# EasyEDA Pro project ProProject_KVM-Card-Mini-HV2.6_2023-09-18.epro, board PCB1
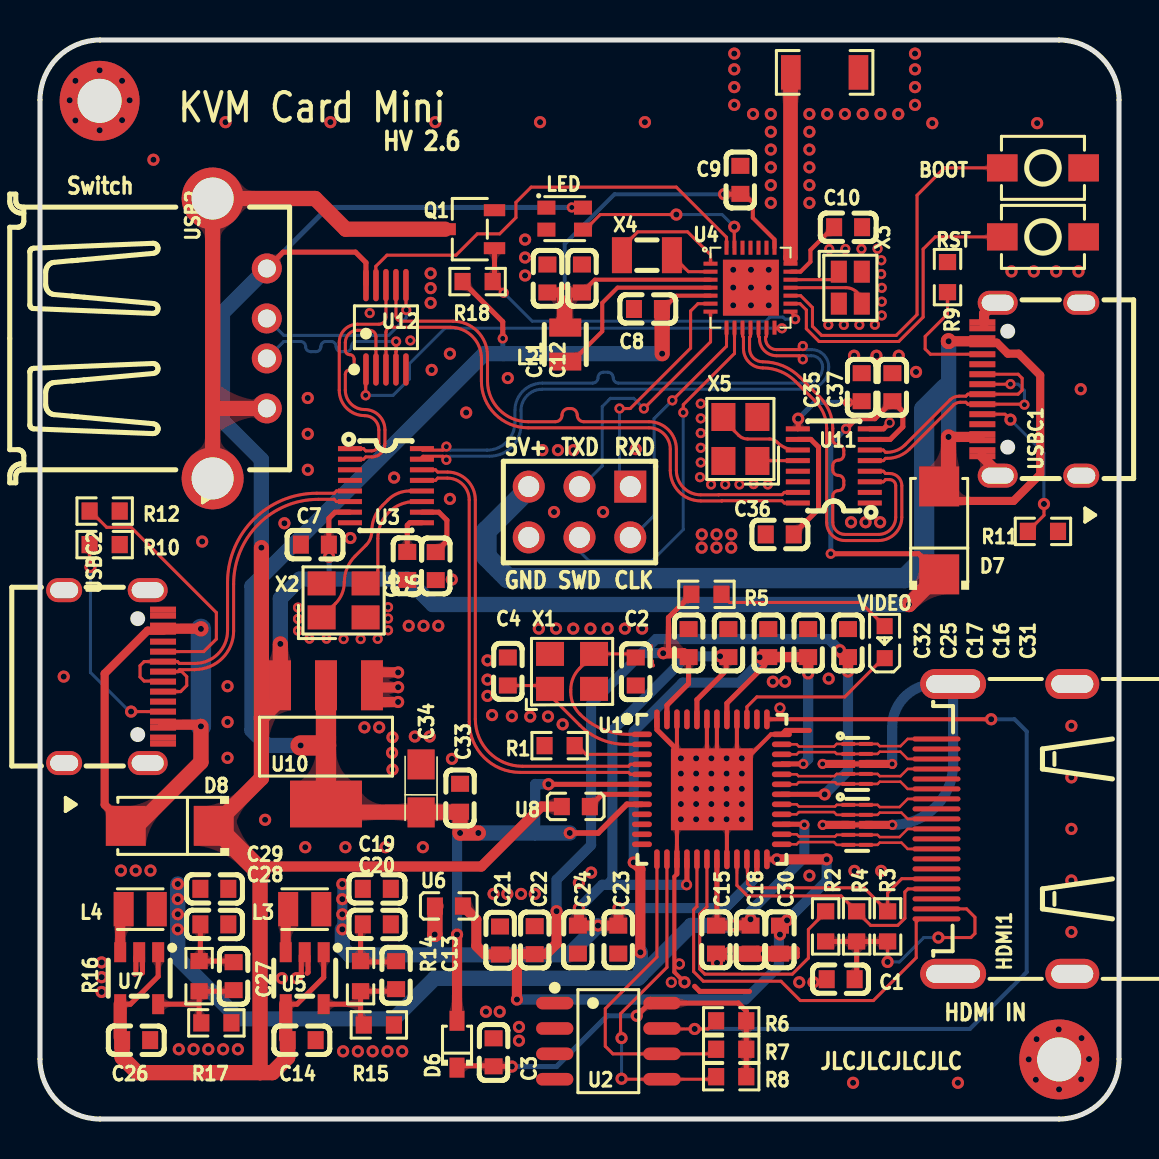
[diagram p4: board, top side]
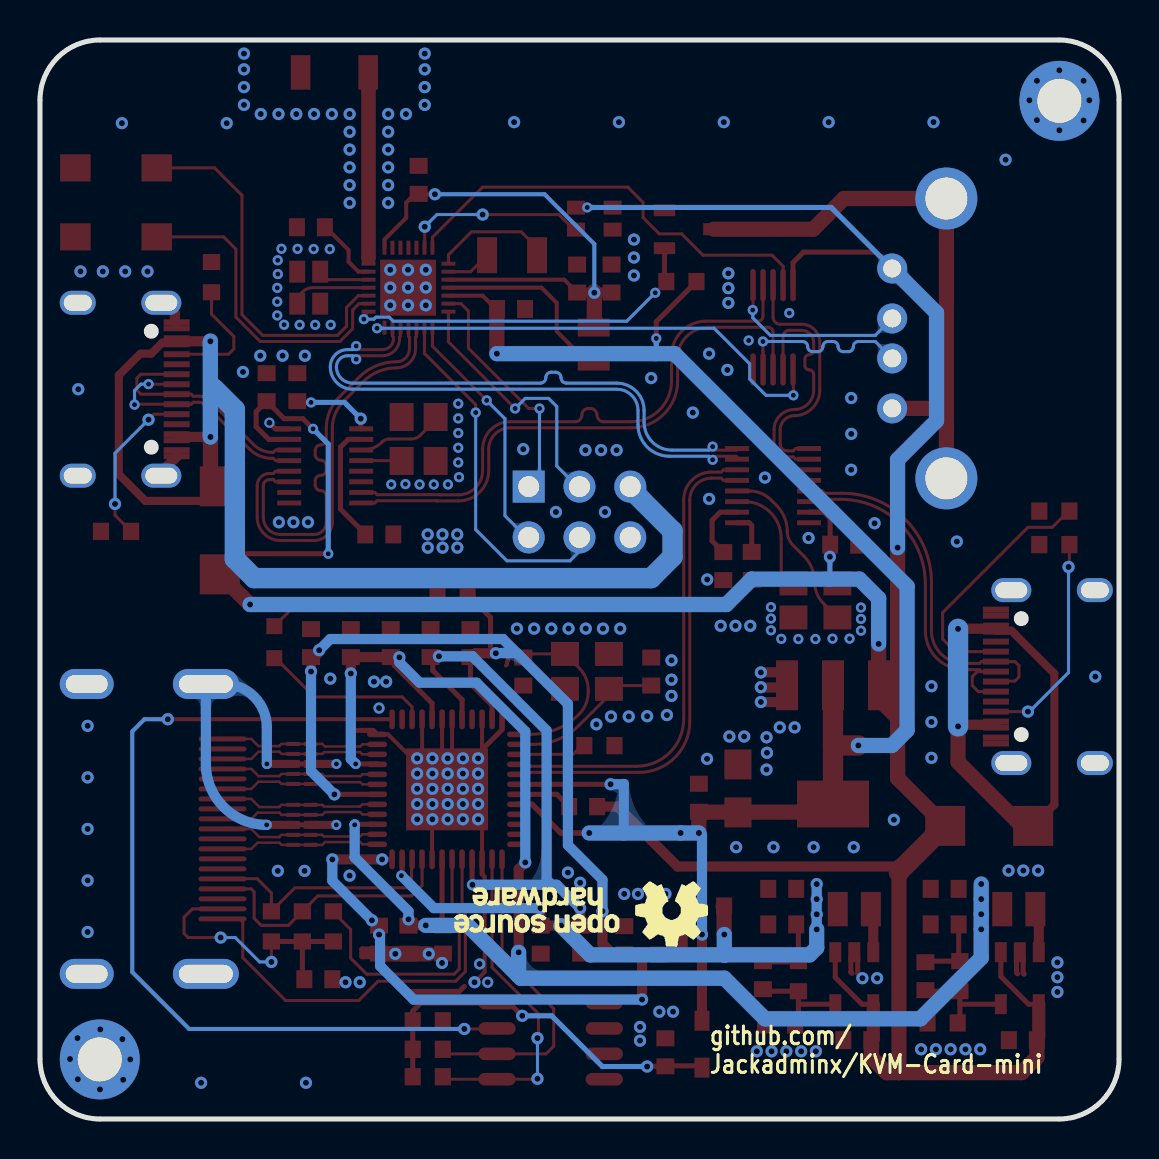
[diagram p5: board, bottom side, seen from below]

Outline 53.98 x 53.98 mm; copper layers: Top Layer, Bottom Layer. Coordinates in mm from the lower left corner of the outline.
Outline path: 0,50.98 arc(0.88,53.1) 3,53.98 50.98,53.98 arc(53.1,53.1) 53.98,50.98 53.98,3 arc(53.1,0.88) 50.98,0 3,0 arc(0.88,0.88) 0,3 0,50.98
Stack: Top Layer 0.035mm / Dielectric1 1.51mm FR4 er 4.5 / Bottom Layer 0.035mm

## Design rules (mm)
net HDMI_CP: DPC
net HDMI_0N: DP0
net HDMI_0P: DP0
net HDMI_1N: DP1
net HDMI_1P: DP1
net HDMI_2N: DP2
net HDMI_2P: DP2
net HDMI_CN: DPC
net USB1_N: USB2
net USB1_P: USB2
net USB_P: USB1
net USB_N: USB1
net USB0_P: HUB-A1
net USB0_N: HUB-A1
net DM4: HUB-A2
net DP4: HUB-A2
net USB1A_P: HUB-B2
net USB1A_N: HUB-B2
net USB0B_N: HUB-A3
net USB0B_P: HUB-A3
net USB1B_N: HUB-B1
net USB1B_P: HUB-B1
net USBA_P: USB-A
net USBA_N: USB-A
template: 用户自定义配置
spacing safeClearance (default): track to track 0.152, other pairs 0.102 to 0.3
track width trackWidth (default): min 0.102, default 0.152, max 2.54
differential pair differentialPair (default): width min 0.127, default 0.254, max 2.54; gap min 0.152, default 0.152
via viaSize (default): diameter min 0.5, default 0.508, max 10; hole min 0.254, default 0.305, max 5.999
net GND uses ANT
net ANT uses ANT

## Placement (name value [footprint] x y rotation side)
BOOT  -  [SW-SMD_L4.0-W2.9-LS5.0]  50.18 47.58 180 top
C1  100nF  [C0603]  40.06 6.99 0 top
C2  20pf  [C0603]  29.8 22.39 90 top
C3  100nF  [C0603]  22.69 3.34 90 top
C4  20pf  [C0603]  23.4 22.39 270 top
C5  10uF  [C0603]  19.8 27.66 270 top
C6  10uF  [C0603]  18.37 27.67 270 top
C7  10uF  [C0603]  13.75 28.73 180 top
C8  2.2uf  [C0603]  30.41 40.52 0 top
C9  100nF  [C0603]  35.04 46.98 90 top
C10  2.2uf  [C0603]  40.43 44.61 180 top
C11  2.2uf  [C0603]  25.39 42.05 270 top
C12  2.2uf  [C0603]  27.11 42.05 270 top
C13  20pf  [C0603]  17.82 7.2 90 top
C14  10uf  [C0603]  13.09 3.95 180 top
C15  100nF  [C0603]  33.82 8.98 90 top
C16  100nF  [C0603]  38.43 23.81 270 top
C17  100nF  [C0603]  36.43 23.81 270 top
C18  100nF  [C0603]  35.55 8.98 90 top
C19  10uf  [C0603]  16.85 11.52 180 top
C20  22uf  [C0603]  16.85 9.74 180 top
C21  22uf  [C0603]  23.02 8.93 270 top
C22  22uf  [C0603]  24.75 8.95 270 top
C23  100nF  [C0603]  28.93 8.98 90 top
C24  100nF  [C0603]  26.91 8.98 90 top
C25  100nF  [C0603]  34.44 23.81 270 top
C26  10uf  [C0603]  4.81 3.95 180 top
C27  20pf  [C0603]  9.69 7.15 90 top
C28  10uf  [C0603]  8.72 9.74 180 top
C29  22uf  [C0603]  8.72 11.52 180 top
C30  100nF  [C0603]  37.02 8.98 90 top
C31  100nF  [C0603]  40.42 23.81 270 top
C32  100nF  [C0603]  32.45 23.81 270 top
C33  100nF  [C0603]  21.02 16.07 90 top
C34  10uF  [CASE-A_3216]  19.07 16.54 90 top
C35  10uF  [C0603]  41.11 36.61 90 top
C36  10uF  [C0603]  37.01 29.24 180 top
C37  10uF  [C0603]  42.64 36.61 90 top
D1  -  [SLP2510P8_L2.5-W1.0-P0.50-BL]  40.88 17.76 270 top
D2  -  [SLP2510P8_L2.5-W1.0-P0.50-BL]  40.88 14.72 270 top
D6  1N5819WS  [SOD-323_L1.8-W1.3-LS2.5-RD]  20.86 3.74 90 top
D7  SS34  [SMA_L4.3-W2.6-LS5.2-RD]  44.98 29.45 90 top
D8  SS34  [SMA_L4.3-W2.6-LS5.2-RD]  6.49 14.67 180 top
H1  210-72-03GB01  [HDR-TH_6P-P2.54-V-R2-C3-S2.54_A2541WV-2X3P]  26.99 30.37 180 top
HDMI1  -  [HDMI-SMD_HDMI-019S]  48.25 14.51 90 top
L1  RFECA3216060A1T  [ANT-SMD_L3.1-W1.6]  39.25 52.36 0 top
L2  22uH  [IND-SMD_L2.0-W1.6_NR201610]  26.28 38.74 90 top
L3  2.2uH  [IND-SMD_L2.0-W1.6]  13.24 10.5 180 top
L4  2.2uH  [IND-SMD_L2.0-W1.6]  5.01 10.5 180 top
LED  WS2812B-2020  [LED-SMD_4P-L2.0-W2.0-TL_WS2812B-2020]  26.25 45.04 0 top
NOREF  -  [Pad_e43]  2.98 50.94 0 top
NOREF#2  -  [Pad_e155]  50.99 2.98 0 top
Q1  AO3400A  [SOT-23-3_L2.9-W1.6-P1.90-LS2.8-BR]  21.5 44.51 0 top
R1  4k7  [R0603]  25.99 18.68 180 top
R2  1k  [R0603]  39.3 9.64 270 top
R3  47k  [R0603]  42.4 9.64 90 top
R4  47k  [R0603]  40.85 9.64 90 top
R5  1k  [R0603]  33.34 26.25 180 top
R6  4k7  [R0603]  34.58 4.91 0 top
R7  4k7  [R0603]  34.58 3.49 0 top
R8  4k7  [R0603]  34.58 2.12 0 top
R9  5.1K  [R0603]  45.4 42.12 270 top
R10  5.1K  [R0603]  3.24 28.74 180 top
R11  5.1K  [R0603]  50.18 29.4 180 top
R12  5.1K  [R0603]  3.24 30.41 180 top
R14  680K  [R0603]  16.04 7.15 90 top
R15  150K  [R0603]  16.95 4.71 180 top
R16  150K  [R0603]  7.96 7.15 90 top
R17  150K  [R0603]  8.82 4.81 180 top
R18  10K  [R0603]  21.89 41.89 180 top
RST  -  [SW-SMD_L4.0-W2.9-LS5.0]  50.18 44.13 180 top
U1  MS2109  [QFN-48_L7.0-W7.0-P0.50-TL-EP4.1]  33.61 16.49 0 top
U2  -  [SOP-8_L4.9-W3.9-P1.27-LS6.0-BL]  28.43 3.9 270 top
U3  SL2.1s  [SSOP-16_L4.6-W2.6-P0.53-LS4.0-BL]  17.31 31.68 270 top
U4  CH582F  [QFN-28_L4.0-W4.0-P0.40-BL-EP2.8]  35.55 41.59 270 top
U5  -  [SOT-23-5_L3.0-W1.7-P0.95-LS2.8-BR]  13.24 7.05 90 top
U6  BLM18PG121SN1D  [L0603]  20.46 10.65 0 top
U7  -  [SOT-23-5_L3.0-W1.7-P0.95-LS2.8-BR]  4.96 7.05 90 top
U8  BLM18PG121SN1D  [L0603]  26.81 15.63 0 top
U10  AMS1117-3.3  [SOT-223-3_L6.5-W3.4-P2.30-LS7.0-BR]  14.31 18.73 90 top
U11  SL2.1s  [SSOP-16_L4.6-W2.6-P0.53-LS4.0-BL]  39.71 32.67 90 top
U12  CH442E  [MSOP-10_L3.0-W3.0-P0.50-LS5.0-BL]  17.31 39.61 0 top
USB2  902-131A1011D10100  [USB-A-TH__USB-AF-90]  9.99 39.05 270 top
USBC1  TYPE-C-31-M-12  [USB-C_SMD-TYPE-C-31-M-12]  49.62 36.51 90 top
USBC2  TYPE-C-31-M-12  [USB-C_SMD-TYPE-C-31-M-12]  3.68 22.13 270 top
VIDEO  -  [LED_0603]  42.25 23.91 90 top
X1  -  [OSC-SMD_4P-L3.2-W2.5-BL]  26.62 22.39 0 top
X2  12MHz  [CRYSTAL-SMD_4P-L3.2-W2.5-BL]  15.19 25.94 0 top
X3  32MHz  [CRYSTAL-SMD_4P-L2.0-W1.6-BL-2]  40.54 41.59 270 top
X4  32.768kHz  [FC-135R_L3.2-W1.5]  30.36 43.21 0 top
X5  12MHz  [CRYSTAL-SMD_4P-L3.2-W2.5-BL]  35.04 34.02 90 top

## Footprints (pads in the part's own frame, mm; a bottom-side part is the same pattern mirrored in y, then rotated)
ANT-SMD_L3.1-W1.6
  rect 0.984x1.728 smd: 1(-1.692,0) 2(1.692,0)
C0603
  rect 0.8x0.9 smd: 1(-0.7,0) 2(0.7,0)
CASE-A_3216
  rect 1.5x1.359 smd: 1(-1.2,0) 2(1.2,0)
CRYSTAL-SMD_4P-L2.0-W1.6-BL-2
  rect 1.1x0.8 smd: 1(-0.8,-0.575) 2(0.8,-0.575) 3(0.8,0.575) 4(-0.8,0.575)
CRYSTAL-SMD_4P-L3.2-W2.5-BL
  rect 1.4x1.2 smd: 1(-1.1,-0.85) 2(1.1,-0.85) 3(1.1,0.85) 4(-1.1,0.85)
FC-135R_L3.2-W1.5
  rect 1x1.8 smd: 1(-1.25,0) 2(1.25,0)
HDMI-SMD_HDMI-019S
  oval 0.25x2.4 smd: 1(4.501,3.396) 2(4.001,3.396) 3(3.501,3.396) 4(3.001,3.396) 5(2.501,3.396) 6(2.001,3.396) 7(1.5,3.396) 8(1,3.396) 9(0.5,3.396) 10(0,3.396) 11(-0.5,3.396) 12(-1,3.396) 13(-1.5,3.396) 14(-2.001,3.396) 15(-2.501,3.396) 16(-3.001,3.396) 17(-3.501,3.396) 18(-4.001,3.396) 19(-4.501,3.396)
  oval 1.5x2.7 hole 0.9x2.1: 20(7.25,-3.397) 21(-7.25,-3.397)
  oval 1.5x3.3 hole 0.9x2.7: 22(7.25,2.564) 23(-7.25,2.564)
HDR-TH_6P-P2.54-V-R2-C3-S2.54_A2541WV-2X3P
  rect 1.6x1.6 hole 1.05: 1(-2.54,-1.27)
  round 1.6 hole 1.05: 2(-2.54,1.27) 3(0,-1.27) 4(0,1.27) 5(2.54,-1.27) 6(2.54,1.27)
IND-SMD_L2.0-W1.6
  rect 1x1.72 smd: 1(0.828,0) 2(-0.828,0)
IND-SMD_L2.0-W1.6_NR201610
  rect 0.9x1.6 smd: 1(-0.85,0) 2(0.85,0)
L0603
  rect 0.8x0.864 smd: 1(-0.7,0) 2(0.7,0)
LED-SMD_4P-L2.0-W2.0-TL_WS2812B-2020
  rect 0.9x0.7 smd: 1(-0.915,0.55) 2(-0.915,-0.55) 3(0.915,-0.55) 4(0.915,0.55)
LED_0603
  rect 0.8x0.8 smd: 1(-0.851,-0.01) 2(0.75,-0.005)
MSOP-10_L3.0-W3.0-P0.50-LS5.0-BL
  oval 0.28x1.62 smd: 1(-1,-2.11) 2(-0.5,-2.11) 3(0,-2.11) 4(0.5,-2.11) 5(1,-2.11) 6(1,2.11) 7(0.5,2.11) 8(0,2.11) 9(-0.5,2.11) 10(-1,2.11)
OSC-SMD_4P-L3.2-W2.5-BL
  rect 1.4x1.2 smd: 1(-1.1,-0.875) 2(1.1,-0.875) 3(1.1,0.875) 4(-1.1,0.875)
Pad_e43
  round 4 hole 2.2: 1(0,0)
Pad_e155
  round 4 hole 2.2: 1(0,0)
QFN-28_L4.0-W4.0-P0.40-BL-EP2.8
  rect 0.2x0.7 smd: 1(-1.2,-2) 2(-0.8,-2) 3(-0.4,-2) 4(-0.001,-2) 5(0.4,-2) 6(0.8,-2) 7(1.2,-2) 15(1.2,2) 16(0.8,2) 17(0.4,2) 18(0,2) 19(-0.4,2) 20(-0.8,2) 21(-1.2,2)
  rect 0.7x0.2 smd: 8(2,-1.2) 9(2,-0.8) 10(2,-0.4) 11(1.999,0) 12(2,0.4) 13(2,0.8) 14(2,1.2) 22(-2,1.2) 23(-2,0.8) 24(-2,0.4) 25(-2,0) 26(-2,-0.4) 27(-2,-0.8) 28(-2,-1.2)
  rect 2.8x2.8 smd: 29(0.001,0.02)
QFN-48_L7.0-W7.0-P0.50-TL-EP4.1
  oval 1x0.28 smd: 1(-3.5,2.75) 2(-3.5,2.25) 3(-3.5,1.75) 4(-3.5,1.25) 5(-3.5,0.75) 6(-3.5,0.25) 7(-3.5,-0.25) 8(-3.5,-0.75) 9(-3.5,-1.25) 10(-3.5,-1.75) 11(-3.5,-2.25) 12(-3.5,-2.75) 25(3.5,-2.75) 26(3.5,-2.25) 27(3.5,-1.75) 28(3.5,-1.25) 29(3.5,-0.75) 30(3.5,-0.25) 31(3.5,0.25) 32(3.5,0.75) 33(3.5,1.25) 34(3.5,1.75) 35(3.5,2.25) 36(3.5,2.75)
  oval 0.28x1 smd: 13(-2.75,-3.5) 14(-2.25,-3.5) 15(-1.75,-3.5) 16(-1.25,-3.5) 17(-0.75,-3.5) 18(-0.25,-3.5) 19(0.25,-3.5) 20(0.75,-3.5) 21(1.25,-3.5) 22(1.75,-3.5) 23(2.25,-3.5) 24(2.75,-3.5) 37(2.75,3.5) 38(2.25,3.5) 39(1.75,3.5) 40(1.25,3.5) 41(0.75,3.5) 42(0.25,3.5) 43(-0.25,3.5) 44(-0.75,3.5) 45(-1.25,3.5) 46(-1.75,3.5) 47(-2.25,3.5) 48(-2.75,3.5)
  rect 4.1x4.1 smd: 49(0,0)
R0603
  rect 0.806x0.864 smd: 1(-0.753,0) 2(0.753,0)
SLP2510P8_L2.5-W1.0-P0.50-BL
  rect 0.201x0.68 smd: 1(-1.001,-0.44) 2(-0.5,-0.44) 4(0.5,-0.44) 5(1.001,-0.44) 6(1.001,0.44) 7(0.5,0.44) 9(-0.5,0.44) 10(-1.001,0.44)
  rect 0.399x0.68 smd: 3(0,-0.44) 8(0,0.44)
SMA_L4.3-W2.6-LS5.2-RD
  rect 2x2 smd: 1(-2.2,0) 2(2.2,0)
SOD-323_L1.8-W1.3-LS2.5-RD
  rect 1x0.75 smd: 1(-1.173,0) 2(1.173,0)
SOP-8_L4.9-W3.9-P1.27-LS6.0-BL
  oval 0.63x1.865 smd: 1(-1.905,-2.683) 2(-0.635,-2.683) 3(0.635,-2.683) 4(1.905,-2.683) 5(1.905,2.683) 6(0.635,2.683) 7(-0.635,2.683) 8(-1.905,2.683)
SOT-23-3_L2.9-W1.6-P1.90-LS2.8-BR
  rect 1.07x0.6 smd: 1(1.235,-0.95) 2(1.235,0.95) 3(-1.235,0)
SOT-23-5_L3.0-W1.7-P0.95-LS2.8-BR
  rect 1x0.6 smd: 1(1.3,-0.95) 2(1.3,0) 3(1.3,0.95) 4(-1.3,0.95) 5(-1.3,-0.95)
SOT-223-3_L6.5-W3.4-P2.30-LS7.0-BR
  rect 2.5x1.1 smd: 1(2.97,-2.3) 2(2.97,0) 3(2.97,2.3)
  rect 2.34x3.6 smd: 4(-2.97,0)
SSOP-16_L4.6-W2.6-P0.53-LS4.0-BL
  rect 0.25x1.2 smd: 1(-1.855,-1.8) 2(-1.325,-1.8) 3(-0.795,-1.8) 4(-0.265,-1.8) 5(0.265,-1.8) 6(0.795,-1.8) 7(1.325,-1.8) 8(1.855,-1.8) 9(1.855,1.8) 10(1.325,1.8) 11(0.795,1.8) 12(0.265,1.8) 13(-0.265,1.8) 14(-0.795,1.8) 15(-1.325,1.8) 16(-1.855,1.8)
SW-SMD_L4.0-W2.9-LS5.0
  rect 1.53x1.36 smd: 1(-2.035,0) 2(2.035,0)
USB-A-TH__USB-AF-90
  round 1.5 hole 0.9: 1(-3.5,1.355) 2(-1,1.355) 3(1,1.355) 4(3.5,1.355)
  round 3.1 hole 2.1: SH1(7,-1.355) SH2(-7,-1.355)
USB-C_SMD-TYPE-C-31-M-12
  oval 1.2x2 hole 0.8x1.6: 0(-4.325,1.706) 1(4.325,1.706)
  oval 1.2x1.8 hole 0.8x1.4: 2(4.325,-2.474) 3(-4.325,-2.474)
  rect 0.3x1.3 smd: A1(-3.35,2.474) A4(-2.55,2.474) A5(-1.25,2.474) A6(-0.25,2.474) A7(0.25,2.474) A8(1.25,2.474) A9(2.55,2.474) A12(3.35,2.474) B1(3.05,2.474) B4(2.25,2.474) B5(1.75,2.474) B6(0.75,2.474) B7(-0.75,2.474) B8(-1.75,2.474) B9(-2.25,2.474) B12(-3.05,2.474)

## Nets
As in the schematic, except:
+5V: C7.1 C14.2 C26.2 C37.1 D7.1 D8.1 LED.4 U3.7 U5.1 U5.4 U7.1 U7.4 U8.1 U10.3 U11.7 U12.10 USB2.1
GND: BOOT.1 C1.1 C2.1 C3.2 C4.1 C5.2 C6.2 C7.2 C8.1 C9.2 C10.1 C11.1 C12.1 C14.1 C15.1 C16.1 C17.1 C18.1 C19.1 C20.1 C21.1 C22.1 C23.1 C24.1 C25.1 C26.1 C28.1 C29.1 C30.1 C31.1 C32.1 C33.2 C34.2 C35.2 C36.2 C37.2 D1.3 D1.8 D2.3 D2.8 H1.6 HDMI1.2 HDMI1.5 HDMI1.8 HDMI1.11 HDMI1.17 HDMI1.20 HDMI1.21 HDMI1.22 HDMI1.23 LED.2 NOREF.1 NOREF#2.1 Q1.2 R1.2 R9.1 R10.1 R11.1 R12.1 R15.1 R17.1 RST.1 U1.15 U1.20 U1.36 U1.40 U1.42 U1.43 U1.46 U1.48 U1.49 U2.1 U2.2 U2.3 U2.4 U3.8 U4.29 U5.2 U7.2 U10.1 U11.8 U12.5 USBC1.0 USBC1.1 USBC1.2 USBC1.3 USBC1.A1 USBC1.A12 USBC1.B1 USBC1.B12 USBC2.0 USBC2.1 USBC2.2 USBC2.3 USBC2.A1 USBC2.A12 USBC2.B1 USBC2.B12 X1.2 X1.4 X2.2 X2.4 X3.2 X3.4 X5.2 X5.4
BOOT: BOOT.2 U4.17
PWM5: LED.3 U4.27
RST: RST.2 U4.16
STATUS: U1.39 VIDEO.1
$1N21126: R5.1 VIDEO.2

Pads without a net: HDMI1 13 14; L1 2; LED 1; U1 9 10 11 12 38 45; U3 3 4; U4 23 24 25 26; U11 1 2 13 14; USBC1 A8 B8; USBC2 A8 B8

## Via types
v1: diameter 0.61, hole 0.305, Top Layer to Bottom Layer, 273 vias
v2: diameter 0.508, hole 0.254, Top Layer to Bottom Layer, 65 vias
v3: diameter 0.559, hole 0.305, Top Layer to Bottom Layer, 4 vias
v4: diameter 0.508, hole 0.305, Top Layer to Bottom Layer, 1 via

## Routing (per net, layer and track width the routed paths; a pad name or vN(x,y) marks a point on that pad's centre or on a via; arc(x,y) is an arc through that point)
1V2: length 83.9
  Top Layer w0.254: v2(38.19,17.76) 37.14,17.76 U1.33 ; v2(38.24,14.72) 38.21,14.75 37.17,14.75 ; C27.2 9.64,7.9 R16.2 8.02,7.96 C28.2 ; 36.26,23 36.26,22.69 34.36,20.8 U1.41 ; C15.2 33.86,9.72 U1.19
  Top Layer w0.508: v1(29.7,12.84) 30.04,12.5 v1(30.04,8.34) ; v1(35.55,9.99) C18.2 35.53,9.69 v1(34.68,9.69) 34.67,9.68 C15.2 ; v1(38.43,22.29) 38.43,23.11 C16.2 C17.2 36.32,23 36.26,23 36.15,23.1 v1(36,23.1)
  Bottom Layer w0.254: v2(38.24,14.72) 38.26,14.72
  Bottom Layer w0.508: v1(38.43,22.29) 38.43,18.01 v2(38.19,17.76) ; v1(36,23.1) 36,22.84 34.99,21.83 32.14,21.83 29.7,19.39 v1(29.7,12.84) ; v1(30.04,8.34) 30.01,8.37 ; 38.23,14.74 38.24,14.74 v2(38.24,14.72) 38.24,13.09 35.55,10.4 v1(35.55,9.99)
  Bottom Layer w0.762: 30.04,7.15 32.58,9.69 v1(34.68,9.69) ; 30.04,7.15 29.93,7.04 19.74,7.04 17.71,5.01 9.94,5.01 6.89,8.06 v1(6.89,9.49) v1(6.89,10.25) v1(6.89,11) v1(6.89,11.76) ; 30.04,7.15 v1(30.04,8.34)
3V3: length 87.6
  Top Layer w0.203: C8.2 31.17,40.52 31.84,41.19 33.55,41.19
  Top Layer w0.254: R18.2 23.15,39.88 v2(23.15,39.05) ; U1.6 25.44,16.74 v1(25.44,16.75)
  Top Layer w0.28: v1(26.5,14.31) 27.93,14.31 29.36,15.74 U1.8
  Top Layer w0.508: v1(20.86,9.23) D6.2
  Top Layer w0.762: C8.2 31.13,40.51 v1(31.13,38.29) ; 14.71,15.35 21,15.35 ; C33.1 v1(21.02,14.31) v1(21.93,14.31)
  Top Layer w1.016: 14.31,18.69 U10.4 14.71,15.35 ; 14.31,18.69 v1(13.04,18.69) ; 14.31,18.69 U10.2
  Bottom Layer w0.254: 23.2,38.29 23.15,38.34 v2(23.15,39.05)
  Bottom Layer w0.508: 24.78,14.21 24.78,14.21 24.78,16.76 24.79,16.75 v1(25.44,16.75) ; v1(20.86,9.23) 20.86,14.22
  Bottom Layer w0.762: v1(21.02,14.31) v1(21.93,14.31) v1(26.5,14.31) ; v1(31.13,38.29) 22.24,38.29 10.6,26.65 10.6,19.45 11.36,18.69 v1(13.04,18.69)
+5V: length 169.7
  Top Layer w0.152: LED.4 27.15,45.6 v2(26.6,45.6)
  Top Layer w0.254: v1(14.46,28.13) 14.46,28.72 C7.1 14.45,30.05 14.76,30.36 U3.7 ; v2(39.56,28.28) 43.95,28.28 D7.1 ; U12.10 16.31,42.84 15.78,43.37 12.17,43.37 USB2.1 ; U11.7 42.53,34 43.17,34.63 43.17,35.39 C37.1 41.77,35.04 40.83,35.04 v2(40.32,34.53) ; 4.01,5.74 4.53,5.74 5.91,7.13 U7.1 ; 12.29,5.74 12.86,5.74 14.19,7.08 U5.1
  Top Layer w0.508: U8.1 25.08,15.63 22.08,12.63 10.96,12.63
  Top Layer w0.66: C14.2 12.29,4.04 12.29,5.74 ; 4.01,5.74 4.01,4.09
  Top Layer w0.762: 11.01,12.38 11.01,12.58 10.96,12.63 ; C14.2 12.39,3.08 11.63,2.32 11.01,2.32 ; 11.01,12.35 11.01,2.32 ; 11.01,2.32 4.87,2.32 4.11,3.08 C26.2 ; v1(11.08,28.58) 11.08,20.07 ; 11.08,20.07 12.01,21 U10.3 12.02,21.72 v1(12.02,23.77) ; 11.08,20.07 11.08,17.05 D8.1 ; D7.1 43.48,25.74 v1(43.47,25.74)
  Top Layer w1.016: 11.01,12.35 11.01,12.38 8.72,14.67 D8.1
  Bottom Layer w0.254: v2(40.32,34.53) 39.56,33.77 v2(39.56,28.28) ; v1(14.46,28.13) 14.46,27.05 14.5,27.01 ; USB2.1 14.4,45.6 v2(26.6,45.6)
  Bottom Layer w0.762: v1(12.02,23.77) 12.02,26.04 12.99,27.01 18.37,27.01 19.64,25.74 v1(43.47,25.74) ; v1(11.08,28.58) 11.08,32.99 9.13,34.93 9.13,40.33 USB2.1
A3V3: length 78.2
  Top Layer w0.254: v1(36.87,12.99) 36.86,12.99 U1.24 ; 31.44,23.3 31.44,25.09 32.59,26.24 R5.2 ; 32.45,23.06 32.45,21.78 31.36,20.7 U1.47 ; U1.30 39.25,16.24 v1(39.25,16.24)
  Top Layer w0.508: v1(40.02,23.45) 40.02,23.35 40.32,23.05 ; 39.3,12.99 v1(36.87,12.99) ; v1(37.02,9.23) 37.02,9.59 v1(37.37,9.94) ; v1(31.18,23.3) 32.2,23.3 32.45,23.06 ; 23.86,8.16 23.86,8.25 C22.2 25.32,8.25 25.84,8.77 v1(25.84,10.4) ; 23.86,8.16 v1(23.86,5.98) ; 23.86,8.16 23.79,8.23 C21.2 22.26,8.23 21.83,8.66 21.83,9.98 21.11,10.7 ; C31.2 v1(40.42,22.39)
  Bottom Layer w0.508: v1(37.02,9.23) 36.97,9.18 36.97,7.65 35.29,5.98 v1(23.86,5.98) ; v1(25.84,10.4) 25.84,11.97 27.57,13.7 27.57,20.76 30.12,23.31 ; 30.12,23.31 30.82,24.01 39.46,24.01 v1(40.02,23.45) ; 30.12,23.31 31.17,23.31 v1(31.18,23.3) ; v1(39.25,16.24) 40.42,17.41 v1(40.42,22.39) ; v1(39.36,12.99) 39.36,11.92 v1(37.37,9.94)
D3V3: length 61.5
  Top Layer w0.254: R14.2 16.04,8.03 ; 16.04,8.03 16.21,7.86 17.78,7.86 C13.2 ; 16.04,8.03 16.04,9.62 C20.2 ; v2(35.9,12.18) 35.86,12.21 U1.23 ; 34.33,23 34.33,22.44 32.86,20.98 U1.44 ; U1.16 32.36,11.74 v3(32.35,11.72)
  Top Layer w0.508: 34.02,23.15 34.17,23.15 34.33,23 ; v1(28.94,10.55) 28.94,9.69 C23.2 v1(27.92,9.68) C24.2 26.96,9.73 v1(26.96,10.55) ; 34.43,23.1 C25.2 ; 34.02,23.15 34.37,23.15 34.43,23.1
  Top Layer w0.762: v1(19.75,9.23) 19.76,9.24 19.76,10.6 19.81,10.65
  Bottom Layer w0.508: v3(32.35,11.72) 28.38,11.72 ; 28.38,11.72 28.64,11.97 28.64,19.44 32.35,23.15 v1(34.02,23.15) ; 28.38,11.72 28.13,11.72 v1(26.96,10.55) ; v1(15.12,9.49) v1(15.12,10.24) v1(15.12,11) v1(15.12,11.75) ; v2(35.9,12.18) 34.28,10.55 v1(28.94,10.55)
  Bottom Layer w0.762: 19.75,8.21 v1(19.75,9.23) ; 19.75,8.21 26.45,8.21 v1(27.92,9.68) ; 19.75,8.21 19.75,8.2 19.74,8.2 ; 19.75,8.21 15.48,8.21 15.12,8.57 v1(15.12,9.49)
GND: length 69.4
  Top Layer w0.203: 30.57,23.66 30.57,22.95 30.62,22.89 30.62,22.74 30.67,22.69 ; 31.86,12.25 31.74,12.13 31.74,7.35 v1(32.24,6.84) ; U1.36 36.57,19.24 35.37,18.04 v1(35.11,18.04) ; v1(32.06,15) 31.86,14.8 U1.15 ; U1.20 34.36,14.73 34.15,14.94 ; 31.86,18.24 U1.46 ; 31.86,18.24 31.86,16.49 ; 31.86,18.24 32.06,18.05 ; U1.40 34.86,16.49 ; U1.42 33.86,17.99 ; U1.43 33.36,17.99
  Top Layer w0.254: 38.49,19.44 37.31,19.44 U1.36 ; 32.75,6.64 33.01,6.38 35.49,6.38 ; v1(12.84,7.05) 13.07,7.28 13.07,8.18 ; 37.88,8.31 37.88,8.5 37.86,8.51 37.17,8.51 ; 37.88,8.31 37.88,8.13 37.86,8.12 37.16,8.12 37.02,8.26 ; 37.88,8.31 37.87,8.31 37.33,8.31 ; 4.75,7.24 4.8,7.29 4.8,8.09 ; 5.08,7.27 5.13,7.32 5.13,8.12 ; D1.3 D1.8 ; U1.15 31.86,12.25 ; 31.86,18.48 30.86,19.48 U1.48 ; v4(42.51,34.83) 42.2,34.53 U11.8 ; 13.41,8.14 13.41,7.34 13.36,7.29 ; D2.3 D2.8
  Top Layer w0.406: D1.8 v2(42.63,17.76) ; D1.3 v2(39.15,17.76) ; D2.8 v2(42.64,14.72) ; v2(39.16,14.72) D2.3
  Top Layer w0.508: v1(17.92,22.34) 17.91,22.35 16.93,22.35 16.88,22.3 ; 16.75,20.93 16.82,20.86 17.91,20.86 v1(17.92,20.86) ; 47.12,33.15 47.71,32.56 47.71,32.1 ; 47.23,39.85 47.23,40.29 47.82,40.88 ; 16.83,21.68 16.92,21.59 17.9,21.59 v1(17.92,21.6)
  Top Layer w0.762: 37.02,8.26 v1(36.21,8.26) v1(34.53,8.26)
  Bottom Layer w0.508: v2(42.63,17.76) 42.63,19.59 arc(43.27,21.13) 44.8,21.76 HDMI1.22 45.68,17.76 arc(44.79,15.61) v2(42.64,14.72)
  vias: v1(1.19,22.13) v1(1.49,50.96) v1(1.77,51.94) v1(1.77,49.95) v1(2.99,52.46) v1(2.99,49.46) v1(3.08,7.83) v1(3.08,7.1) v1(3.08,6.36) v1(4.11,51.94) v1(4.11,49.97) v1(4.05,12.43) v1(4.49,50.96) v1(4.79,12.43) v1(5.53,12.43) v1(5.67,47.99) v1(6.94,3.49) v1(7.68,3.49) v1(8.11,28.89) v1(8.42,3.49) v1(9.16,3.49) v1(9.28,49.87) v1(9.38,21.65) v1(9.38,19.86) v1(9.38,18.07) v1(9.9,3.49) v1(11.26,14.97) v1(12.1,7.05) v1(12.23,29.8) v1(13.27,13.6) v1(13.4,36.07) v1(13.4,34.27) v1(13.4,32.48) v1(14.53,49.87) v1(15.16,3.39) v1(15.28,13.6) v1(15.53,29.07) v1(15.9,3.39) v1(16.23,19.59) v1(16.64,3.39) v1(16.97,19.59) v1(17.29,13.6) v1(17.38,3.39) v1(17.61,18.32) v1(17.71,32.09) v1(17.63,19.1) v1(17.63,17.48) v1(18.12,3.39) v1(18.45,24.67) v1(18.75,19.14) v1(19.19,24.67) v1(19.16,13.6) v1(19.49,19.14) v1(19.54,42.31) v1(19.54,41.57) v1(19.54,40.83) v1(19.59,37.47) v1(19.77,49.87) v1(19.93,24.67) v1(20.51,38.29) v1(20.51,31.02) v1(20.6,26.99) v1(20.61,18.02) v1(21.32,35.34) v1(22.31,5.37) v1(22.39,22.95) v1(22.39,21.98) v1(22.39,21.17) v1(22.62,20.21) v1(22.69,11.26) v1(23,5.37) v1(23.4,37.07) v1(23.38,11.26) v1(23.61,20.15) v1(23.96,4.61) v1(23.96,3.92) v1(24.07,11.26) v1(24.27,44) v1(24.27,43.1) v1(24.27,42.2) v1(24.53,20.14) v1(24.75,11.26) v1(25.02,49.87) v1(24.95,24.53) v1(25.13,33.46) v1(25.42,20.14) v1(25.72,30.37) v1(25.82,24.53) v1(25.91,33.46) v1(26.15,19.75) v1(26.69,33.46) v1(26.68,24.53) v1(26.96,11.82) v1(27.54,24.53) v1(27.57,12.33) v1(28.17,30.37) v1(28.4,24.53) v1(29.26,24.53) v1(29.8,33.51) v1(30.12,24.53) v1(30.26,49.87) v1(32.06,18.04) v1(32.06,17.28) v1(32.06,16.52) v1(32.06,15.76) v1(32.83,18.04) v1(32.83,17.28) v1(32.83,16.52) v1(32.83,15.76) v1(32.83,15) v1(33.11,29.24) v1(33.1,28.58) v1(33.59,18.04) v1(33.59,17.28) v1(33.59,16.52) v1(33.59,15.76) v1(33.59,15) v1(33.85,29.24) v1(33.84,28.58) v1(33.87,7.81) v1(34.35,18.04) v1(34.35,17.28) v1(34.35,16.52) v1(34.35,15.76) v1(34.35,15) v1(34.58,29.24) v1(34.58,28.58) v1(34.68,42.48) v1(34.68,41.6) v1(34.68,40.71) v1(34.73,53.3) v1(34.73,52.51) v1(34.73,51.62) v1(34.73,50.73) v1(35.11,17.28) v1(35.11,16.52) v1(35.11,15.76) v1(35.11,15) v1(35.57,42.48) v1(35.57,41.6) v1(35.57,40.71) v1(35.67,50.28) v1(36.46,42.48) v1(36.46,41.6) v1(36.46,40.71) v1(36.56,50.28) v1(36.56,49.39) v1(36.56,48.5) v1(36.56,47.61) v1(36.56,46.72) v1(36.56,45.83) v1(36.66,21.88) v1(37.27,21.88) v1(37.98,6.84) v1(38.49,50.28) v1(38.49,49.39) v1(38.49,48.5) v1(38.49,47.61) v1(38.49,46.72) v1(38.49,45.83) v1(38.49,12.18) v1(38.7,6.84) v1(39.38,50.28) v1(39.46,22.03) v1(40.27,50.28) v1(40.57,29.85) v1(40.68,1.81) v1(40.73,38.19) v1(40.74,12.41) v1(41.16,50.28) v1(41.3,29.85) v1(41.84,38.19) v1(42.05,50.28) v1(42.03,29.85) v1(42.08,12.41) v1(42.94,50.28) v1(42.96,38.19) v1(43.77,53.3) v1(43.77,52.51) v1(43.77,51.62) v1(43.77,50.73) v1(43.83,37.37) v1(44.64,49.82) v1(45.92,1.81) v1(48.6,42.4) v1(49.46,2.98) v1(49.72,42.4) v1(49.82,1.97) v1(49.88,49.82) v1(49.86,4) v1(50.84,42.4) v1(50.96,4.48) v1(50.98,1.48) v1(51.6,19.67) v1(51.6,17.09) v1(51.6,14.51) v1(51.6,11.93) v1(51.6,9.36) v1(51.95,42.4) v1(52.07,36.51) v1(52.11,4.05) v1(52.09,1.99) v1(52.48,3) v2(12.91,25.59) v2(12.91,25.02) v2(12.91,24.43) v2(13.48,24.03) v2(14.33,24.03) v2(15.19,24.01) v2(16.04,24.01) v2(16.5,40.32) v2(16.9,24.02) v2(17.41,25.61) v2(17.41,25.04) v2(17.41,24.45) v2(18.53,38.95) v2(33.02,32.11) v2(33.06,35.79) v2(33.06,35.05) v2(33.06,34.31) v2(33.06,33.58) v2(33.06,32.84) v2(33.57,31.74) v2(34.28,31.74) v2(34.99,31.74) v2(35.7,31.76) v2(36.41,31.74) v2(39.48,43.52) v2(39.44,39.73) v2(40.21,39.73) v2(40.29,43.52) v2(40.99,39.73) v2(41.1,43.53) v2(41.77,39.74) v2(41.9,43.54) v2(42.09,42.96) v2(42.08,42.27) v2(42.11,41.58) v2(42.11,40.89) v2(42.11,40.2) v3(31.58,6.84) v3(31.99,7.76) v3(37.02,20.56)
V33USB_2: length 2.9
  Top Layer w0.254: 27.51,15.63 28.12,16.24 U1.7
VBUS: length 27.5
  Top Layer w0.406: 6.18,24.43 5.38,24.43 3.24,22.29 3.24,15.72 D8.2
  Top Layer w0.508: 8.05,24.53 6.16,24.53 ; v1(8.05,19.64) 7.97,19.73 6.16,19.73
  Top Layer w0.762: v1(8.05,19.64) 8.05,17.86 4.86,14.67 D8.2 ; v1(8.05,24.52) 8.05,24.53
  Bottom Layer w1.016: v1(8.05,19.64) v1(8.05,24.52)
VBUS1: length 60.6
  Top Layer w0.406: 45.09,30.92 48.71,30.92 50.04,32.25 50.04,37.21 48.96,38.29 48.42,38.29 47.87,38.84 47.16,38.84
  Top Layer w0.508: v1(45.45,34.12) 47.01,34.12 ; v1(45.46,38.91) 46.99,38.91
  Top Layer w0.762: 45.45,38.91 45.45,38.91 ; 45.45,38.91 45.45,38.94 ; 45.45,38.91 v1(45.46,38.91) ; v1(45.45,34.12) 45.45,32.11 D7.2
  Bottom Layer w0.762: v1(45.46,38.91) 45.46,34.13 v1(45.45,34.12)
  Bottom Layer w1.016: 24.45,31.53 22.34,29.42 22.34,28.13 23.4,27.06 43.27,27.06 44.23,28.03 44.23,35.5 45.28,36.55
VDD18: length 3.2
  Top Layer w0.254: U3.10 19.95,30.36 20.36,29.96 20.36,28.92 C5.1
VDD33: length 2.1
  Top Layer w0.254: U3.9 18.5,29.83 18.37,29.7 C6.1
ANT: length 8.5
  Top Layer w0.729: 37.54,43.08 37.55,43.09 37.55,51.53 37.56,51.55
BOOT: length 18.9
  Top Layer w0.152: U4.17 38.05,41.19 38.64,40.6 38.64,39.66 39.1,39.2 42.84,39.2 43.88,40.24 43.88,46.21 45.25,47.58 BOOT.2
CC1: length 12.7
  Top Layer w0.152: USBC2.A5 8.19,23.38 8.82,24.01 8.82,25.33 4.56,29.6 3.34,29.6 2.53,30.41 R12.2
CC1_B: length 8.1
  Top Layer w0.152: v1(48.55,34.99) 48.28,35.26 USBC1.A5 ; v1(50.23,30.77) 50.23,30.2 R11.2
  Bottom Layer w0.152: v1(50.23,30.77) 50.23,33.31 v1(48.55,34.99)
CC2: length 10.9
  Top Layer w0.152: v1(2.53,27.62) 2.48,27.66 R10.2 ; USBC2.B5 v1(4.56,20.38)
  Bottom Layer w0.152: v1(4.56,20.38) 4.48,20.38 2.53,22.34 v1(2.53,27.62)
CC2_B: length 6.2
  Top Layer w0.152: 45.4,41.3 45.4,40.27 44.28,39.15 44.28,38.52 44.55,38.26 USBC1.B5
DM4: length 24.3
  Top Layer w0.152: U1.5 29.54,17.24 29.44,17.34 24.01,17.34 arc(22.22,18.09) 21.47,19.88 21.47,30.97 arc(21.16,31.74) 20.39,32.06 19.9,32.06 19.78,31.95 U3.13
DP4: length 24.2
  Top Layer w0.152: U3.14 19.78,32.48 19.9,32.37 20.39,32.37 arc(21.37,31.96) 21.78,30.97 21.78,20.01 arc(22.47,18.34) 24.14,17.65 29.44,17.65 29.54,17.74 U1.4
EN#: length 22.1
  Top Layer w0.152: U4.28 34.35,44.11 31.84,46.62 24.57,46.62 23.81,45.86 23.81,45.09 23,44.28 21.88,44.28 20.81,43.21 17.36,43.21 16.8,42.66 16.8,41.73 U12.9
HDMI_0N: length 8
  Top Layer w0.127: 44.85,15.01 43.41,15.01 43.09,15.33 42.01,15.33 41.9,15.22 D2.9 D2.2 39.86,15.22 39.72,15.35 37.97,15.35 37.86,15.24 U1.28
HDMI_0P: length 8
  Top Layer w0.127: 44.85,16.01 43.41,16.01 43,15.61 42.01,15.61 41.9,15.72 D2.10 D2.1 39.86,15.72 39.77,15.63 37.97,15.63 37.86,15.74 U1.29
HDMI_1N: length 8
  Top Layer w0.127: U1.31 37.86,16.74 37.96,16.85 39.77,16.85 39.86,16.76 D1.5 D1.6 41.9,16.76 42.01,16.87 43.05,16.87 43.41,16.51 44.85,16.51
HDMI_1P: length 8
  Top Layer w0.127: 44.85,17.51 43.41,17.51 43.05,17.15 42.01,17.15 41.9,17.26 D1.7 D1.4 39.86,17.26 39.75,17.15 39.56,17.15 ; 39.56,17.15 37.95,17.15 37.86,17.24 U1.32
HDMI_2N: length 8
  Top Layer w0.127: 44.85,18.01 43.41,18.01 43.05,18.37 42.01,18.37 41.9,18.26 D1.9 D1.2 39.86,18.26 39.77,18.35 37.97,18.35 37.86,18.24 U1.34
HDMI_2P: length 8
  Top Layer w0.127: U1.35 37.86,18.74 37.97,18.63 39.73,18.63 39.86,18.76 D1.1 D1.10 41.9,18.76 42.01,18.65 43.05,18.65 43.41,19.01 44.85,19.01
HDMI_CN: length 8
  Top Layer w0.127: 44.85,13.51 43.41,13.51 43.09,13.83 42.01,13.83 41.9,13.72 D2.6 D2.5 39.86,13.72 39.72,13.85 37.97,13.85 37.86,13.74 U1.25
HDMI_CP: length 8
  Top Layer w0.127: 44.85,14.51 43.41,14.51 43,14.1 42.01,14.1 41.9,14.22 D2.7 D2.4 39.86,14.22 39.78,14.13 37.97,14.13 37.86,14.24 U1.26
HDMIDET: length 14.2
  Top Layer w0.152: R2.1 39.3,10.35 38.44,9.48 38.44,8.05 37.64,7.25 33.26,7.25 33.01,7.5 33.01,10.26 33.36,10.62 U1.18
HDMIHPD: length 20.9
  Top Layer w0.152: 44.6,10.01 43.99,10.01 43.83,9.86 43.83,8.07 41.69,5.93 38.03,5.93 37.07,6.89 33.18,6.89 32.7,7.38 32.7,10.46 32.86,10.63 U1.17
HDMISCL: length 12.2
  Top Layer w0.152: U1.22 35.39,12.97 35.39,11.77 35.6,11.57 41.23,11.57 R3.2 42.4,11.31 43.11,12.02 44.61,12.02
HDMISDA: length 13.5
  Top Layer w0.152: 44.7,11.51 43.42,11.51 43.27,11.36 43.27,10.04 42.91,9.69 41.56,9.69 R4.2 40.08,11.16 35.39,11.16 34.86,11.69 U1.21
HXIN: length 9.1
  Top Layer w0.152: U1.1 29.45,19.24 arc(28.13,19.51) 27.01,20.25 arc(26.67,20.76) 26.55,21.36 26.55,21.47 arc(26.67,22.06) 27,22.55 X1.3 29.37,23.27 arc(29.6,23.22) C2.2
HXOUT: length 7.9
  Top Layer w0.152: C4.2 25.11,21.69 arc(25.33,21.64) X1.1 arc(25.58,21.21) 25.75,20.95 27.01,19.69 arc(28.06,18.99) 29.31,18.74 U1.2
IN: length 24.4
  Top Layer w0.152: v2(16.29,36.2) 16.29,37.48 U12.1 ; U4.14 36.78,39.56 v2(37.12,39.56)
  Bottom Layer w0.152: v2(37.12,39.56) 20.25,39.56 18.48,37.78 18.48,37.02 17.66,36.2 v2(16.29,36.2)
PWM5: length 9.2
  Top Layer w0.152: v1(31.84,45.25) 28.03,45.25 27.27,44.49 LED.3 ; U4.27 34.73,43.6 v1(34.73,44.64)
  Bottom Layer w0.152: v1(31.84,45.25) 34.12,45.25 v1(34.73,44.64)
PWM7: length 18.3
  Top Layer w0.152: v2(23.2,41.34) 23.2,41.34 R18.1 ; U4.15 37.78,40.15 v2(37.78,40.01)
  Top Layer w0.254: Q1.1 22.74,41.99 R18.1
  Bottom Layer w0.152: v2(37.78,40.01) 37.27,40.01 37.17,40.12 36.51,40.12 36.31,39.91 24.62,39.91 v2(23.2,41.34)
RST: length 16.1
  Top Layer w0.152: 37.55,40.79 38.02,40.79 38.34,40.47 38.34,39.53 38.98,38.9 42.96,38.9 44.18,40.12 44.18,43.52 44.79,44.13 RST.2
RXD1: length 12.3
  Top Layer w0.152: 33.55,40.79 32.92,40.79 32.55,40.42 32.55,38.56 29.53,35.54 v2(28.99,35.54)
  Bottom Layer w0.152: 29.53,31.53 29.04,31.53 28.99,31.59 v2(28.99,35.54)
SCL: length 16.5
  Top Layer w0.152: U1.13 30.86,8.11 28.28,5.52 28.28,3.64 28.66,3.26 U2.6 33.57,3.26 33.83,3.52 33.83,3.74
SDA: length 16.8
  Top Layer w0.152: v1(29.09,4.05) 29.04,4.1 29.04,5.27 31.36,7.59 U1.14 ; R8.1 33.7,1.99 U2.5 29.12,1.99 v1(29.09,2.02)
  Bottom Layer w0.152: v1(29.09,2.02) v1(29.09,4.05)
STATUS: length 8.5
  Top Layer w0.152: U1.39 35.36,20.62 35.86,21.12 40.25,21.12 42.19,23.06 VIDEO.1
SWCLK: length 12.6
  Top Layer w0.152: v2(31.63,35.95) 34.35,38.66 U4.8
  Bottom Layer w0.152: v2(31.63,35.95) 30.72,35.04 30.72,30.18 29.53,28.99
SWDIO: length 17.8
  Top Layer w0.152: U4.9 34.74,38.3 32.18,35.74 v2(32.18,35.34)
  Bottom Layer w0.152: 26.99,28.99 26.99,28.4 27.47,27.92 30.62,27.92 32.18,29.49 v2(32.18,35.34)
TXD1: length 13.3
  Top Layer w0.152: v2(30.21,35.54) 33.55,38.88 U4.7
  Bottom Layer w0.152: 26.99,31.53 28.13,32.67 28.13,35.65 28.54,36.05 29.7,36.05 v2(30.21,35.54)
USB0_N: length 28.2
  Top Layer w0.152: v2(38.16,38.67) 37.98,38.49 36.85,38.49 arc(36.46,38.65) 36.3,39.04 36.3,39.12 36.35,39.16 U4.13 ; v2(20.33,32.98) 20.15,33.16 19.16,33.16 19.11,33.1 U3.15
  Bottom Layer w0.152: v2(20.33,32.98) 20.51,33.16 22.49,33.16 arc(23.6,33.62) 24.06,34.73 24.06,35.44 arc(24.38,36.2) 25.13,36.51 38.34,36.51 arc(39.13,36.84) 39.46,37.63 arc(39.2,38.24) 38.59,38.49 38.34,38.49 v2(38.16,38.67)
USB0_P: length 28.2
  Top Layer w0.152: v2(20.33,33.64) 20.15,33.46 19.14,33.46 19.11,33.49 U3.16 ; v2(38.16,38.01) 37.98,38.19 36.85,38.19 arc(36.24,38.43) 35.99,39.04 35.99,39.12 35.95,39.16 U4.12
  Bottom Layer w0.152: 33.54,36.81 28.95,36.81 arc(28.76,36.89) 28.68,37.09 arc(28.6,37.28) 28.4,37.36 28.19,37.36 arc(27.99,37.28) 27.92,37.09 arc(27.84,36.89) 27.64,36.81 25.13,36.81 arc(24.16,36.41) 23.76,35.44 23.76,34.86 arc(23.35,33.87) 22.36,33.46 20.51,33.46 v2(20.33,33.64) ; v2(38.16,38.01) 38.34,38.19 38.59,38.19 arc(38.99,38.02) 39.15,37.63 arc(38.91,37.05) 38.34,36.81 33.55,36.81
USB0B_N: length 12.6
  Top Layer w0.152: U12.8 17.31,40.12 arc(17.2,39.86) 16.95,39.76 15.89,39.76 arc(15.24,39.49) 14.97,38.85 14.97,36.46 arc(15.34,35.56) 16.24,35.19 arc(16.74,34.98) 16.95,34.48 16.95,33.78 arc(16.85,33.53) 16.6,33.43 16.3,33.43 16.18,33.54 U3.1
USB0B_P: length 12.6
  Top Layer w0.152: U3.2 16.18,33.01 16.3,33.12 16.6,33.12 arc(17.06,33.31) 17.26,33.78 17.26,34.48 arc(16.96,35.2) 16.24,35.49 arc(15.56,35.78) 15.28,36.46 15.28,37.26 arc(15.34,37.41) 15.5,37.48 arc(15.65,37.54) 15.72,37.7 15.72,38.02 arc(15.65,38.17) 15.5,38.24 arc(15.34,38.3) 15.28,38.46 15.28,38.85 arc(15.45,39.28) 15.89,39.46 16.49,39.46 arc(16.72,39.36) 16.81,39.14 U12.2
USB1_N: length 11.2
  Top Layer w0.152: v2(48.55,36.76) 48.55,36.76 47.51,36.76 47.5,36.77 ; USBC1.B7 46.42,35.76 46.32,35.86 46.04,35.86 arc(45.85,35.82) 45.7,35.71 43.5,33.51 arc(42.98,33.17) 42.38,33.05 42.3,33.05 42.19,32.94 41.51,32.94 ; 47.46,35.76 47.46,35.76 49.23,35.76 v2(49.25,35.74)
  Bottom Layer w0.152: v2(49.25,35.74) 49.25,36.45 48.93,36.76 v2(48.55,36.76)
USB1_P: length 11.2
  Top Layer w0.152: U11.6 42.19,33.47 42.3,33.35 42.38,33.35 arc(42.87,33.45) 43.28,33.73 45.53,35.97 arc(45.73,36.11) 45.98,36.16 46.32,36.16 46.42,36.26 USBC1.A6 ; 47.24,37.26 48.93,37.26 49.13,37.06 49.13,36.46 48.93,36.26 47.4,36.26 47.37,36.24
USB1A_N: length 20.4
  Top Layer w0.152: 41.51,31.88 42.19,31.88 42.3,31.99 42.51,31.99 arc(42.72,31.9) 42.81,31.68 42.81,30.11 arc(42.56,29.5) 41.95,29.24 40.27,29.24 arc(39.84,29.42) 39.66,29.85 39.66,31.16 arc(39.74,31.36) 39.94,31.44 arc(40.13,31.52) 40.21,31.71 40.21,31.92 arc(40.13,32.12) 39.94,32.2 arc(39.74,32.28) 39.66,32.48 39.66,32.69 arc(39.74,32.88) 39.94,32.96 arc(40.13,33.04) 40.21,33.24 40.21,33.45 arc(40.13,33.64) 39.94,33.72 arc(39.74,33.8) 39.66,34 39.66,34.55 arc(39.49,35.4) 39.01,36.11 38.02,37.11 arc(37.16,37.68) 36.15,37.88 arc(35.69,38.07) 35.5,38.54 35.5,39.12 35.55,39.16 U4.11
USB1A_P: length 20.5
  Top Layer w0.152: U4.10 35.15,39.16 35.19,39.12 35.19,38.54 arc(35.47,37.86) 36.15,37.58 arc(37.05,37.4) 37.8,36.89 38.8,35.9 arc(39.21,35.28) 39.36,34.55 39.36,29.85 arc(39.62,29.21) 40.27,28.94 41.95,28.94 arc(42.77,29.28) 43.11,30.11 43.11,31.68 arc(42.94,32.11) 42.51,32.29 ; U11.4 42.19,32.41 42.3,32.29 42.5,32.29
USB1B_N: length 28.6
  Top Layer w0.152: U12.7 17.81,40.17 arc(17.88,39.99) 18.07,39.91 20.66,39.91 arc(21.88,39.41) 22.39,38.18 22.39,36.92 arc(22.98,35.48) 24.42,34.88 25.79,34.88 arc(26.02,34.98) 26.11,35.21 arc(26.21,35.45) 26.45,35.54 26.55,35.54 arc(26.78,35.45) 26.88,35.21 arc(26.97,34.98) 27.21,34.88 30.47,34.88 arc(31.44,34.48) 31.84,33.51 31.84,32.45 arc(32.19,31.58) 33.06,31.23 33.95,31.23 33.96,31.23 37.12,31.23 37.24,31.35 U11.15
USB1B_P: length 28.6
  Top Layer w0.152: U11.16 37.24,30.82 37.12,30.93 34.11,30.93 34.11,30.92 34.11,30.92 33.06,30.92 arc(31.98,31.37) 31.53,32.45 31.53,33.51 arc(31.22,34.27) 30.47,34.58 24.42,34.58 arc(22.77,35.26) 22.08,36.92 22.08,38.06 arc(21.63,39.15) 20.53,39.61 17.56,39.61 arc(17.38,39.53) 17.31,39.36 U12.3
USB_N: length 18.4
  Top Layer w0.152: U3.5 14.83,31.42 14.72,31.31 13.85,31.31 arc(10.69,30) 9.38,26.84 9.38,24.42 arc(8.91,23.27) 7.76,22.79 6.97,22.79 6.88,22.88 USBC2.B7 6.16,22.85 ; 6.14,22.88 5.21,22.88 5.01,22.68 5.01,22.11 5.21,21.91 6.17,21.91
USB_P: length 18.5
  Top Layer w0.152: 6.94,22.39 7.09,22.39 7.34,22.13 7.34,21.69 7.04,21.38 6.16,21.38 ; 6.94,22.39 6.89,22.39 ; 6.94,22.39 6.93,22.38 6.88,22.38 ; 6.89,22.39 6.16,22.39 ; 6.89,22.39 6.98,22.48 7.75,22.48 7.76,22.48 7.76,22.49 arc(9.12,23.05) 9.69,24.42 9.69,26.76 arc(10.93,29.76) 13.93,31 14.72,31 14.83,30.89 U3.6 ; 6.89,22.39 6.88,22.38 ; 6.16,22.39 USBC2.A6 6.88,22.38 ; 6.16,22.39 6.15,22.39 6.14,22.38 ; 6.16,22.39 6.16,22.43
USBA_N: length 9.3
  Top Layer w0.152: U12.6 18.31,40.49 v2(18.32,40.47)
  Bottom Layer w0.152: v2(18.32,40.47) 18.32,40.09 17.44,39.2 12.2,39.2 USB2.2
USBA_P: length 9.4
  Top Layer w0.152: U12.4 17.81,38.38 17.82,38.39 v2(17.82,38.9)
  Bottom Layer w0.152: v2(17.82,38.9) 15.83,38.9 arc(15.65,38.82) 15.58,38.64 arc(15.5,38.46) 15.32,38.39 15.07,38.39 arc(14.89,38.46) 14.82,38.64 arc(14.74,38.82) 14.56,38.9 14.31,38.9 arc(14.13,38.82) 14.05,38.64 arc(13.98,38.46) 13.8,38.39 13.55,38.39 arc(13.37,38.46) 13.29,38.64 arc(13.22,38.82) 13.04,38.9 12.2,38.9 USB2.3
VDCIA: length 25.8
  Top Layer w0.203: 25.4,41.34 C11.2 ; C12.2 27.76,41.99 33.55,41.99 ; U4.22 36.74,44 35.66,45.08 35.66,45.84 35.1,46.4 35.1,46.45
  Top Layer w0.254: 35.1,46.45 34.91,46.26 v1(34.22,46.26)
  Top Layer w0.508: C12.2 C11.2
  Top Layer w0.762: 26.2,39.96 26.25,40.01 26.25,41.4
  Bottom Layer w0.203: v1(26.25,41.34) 26.25,43.77 28.74,46.26 v1(34.22,46.26)
VSW: length 9.6
  Top Layer w0.203: 26.2,38.14 26.86,38.14 28.13,39.4 28.13,40.83 28.89,41.59 U4.4
WP: length 46
  Top Layer w0.152: R6.1 33.42,4.5 v1(32.75,4.5) 31.14,4.5 U2.7
  Top Layer w0.203: v1(47.58,20) 36.37,20 U1.37
  Bottom Layer w0.203: v1(47.58,20) 48.75,20 49.36,19.39 49.36,7.35 46.52,4.5 v1(32.75,4.5)
X32KI: length 2.3
  Top Layer w0.152: U4.2 32.44,42.39 31.61,43.21
X32KO: length 6.1
  Top Layer w0.152: 33.55,42.79 33.55,43.23 32.4,44.38 29.91,44.38 29.11,43.59 X4.1
X32MI: length 2.6
  Top Layer w0.152: 37.55,41.99 39.56,41.99 arc(39.85,42.11) X3.1
X32MO: length 4
  Top Layer w0.152: U4.18 40.31,41.59 arc(40.88,41.35) X3.3
XIN: length 8.8
  Top Layer w0.152: U3.12 18.49,31.42 arc(17.9,31.3) 17.41,30.97 17.14,30.7 arc(16.74,30.1) 16.6,29.4 arc(16.52,29.02) 16.31,28.7 15.76,28.16 arc(15.37,27.56) 15.23,26.86 arc(15.11,26.28) 14.78,25.79 X2.1
XIN_2: length 1.8
  Top Layer w0.152: 36.14,32.92 36.16,32.94 37.91,32.94
XOUT: length 5.9
  Top Layer w0.152: U3.11 18.75,30.89 arc(17.44,30.35) 16.9,29.04 16.9,27.41 arc(16.72,26.97) X2.3
XOUT_2: length 4.2
  Top Layer w0.152: U11.11 37.83,33.47 arc(37.31,33.57) 36.87,33.87 arc(36.7,33.98) 36.5,34.02 35.39,34.02 arc(35.16,34.07) 34.96,34.2 34.73,34.43 arc(34.52,34.75) 34.44,35.12
$1N21126: length 8.8
  Top Layer w0.152: VIDEO.2 41.07,25.84 34.5,25.84 R5.1
$1N21165: length 13.9
  Top Layer w0.152: 44.85,10.51 46.35,10.51 46.77,10.09 46.77,9.28 46.57,9.08 v1(44.94,9.08) ; v1(42.4,7.86) R3.1
  Top Layer w0.254: R4.1 40.85,7.09 C1.2 ; R4.1 R3.1 ; R4.1 R2.2
  Bottom Layer w0.152: v1(42.4,7.86) 42.99,7.86 44.21,9.08 v1(44.94,9.08)
$1N21216: length 19.3
  Top Layer w0.254: v1(29.86,5.17) 29.86,5.17 30.5,5.8 U2.8 34.93,5.8 35.33,5.4 R7.2 R8.2 ; C3.1 23.6,2.64 v1(23.61,2.62) ; 20.81,2.66 22.57,2.66 22.69,2.79
  Bottom Layer w0.254: v1(29.86,5.17) 28.38,5.17 25.84,2.62 v1(23.61,2.62)
$1N21222: length 3.5
  Top Layer w0.152: R1.1 26.88,18.68 27.32,18.24 U1.3
$2N50514: length 4.1
  Top Layer w0.254: v1(37.93,35.04) 37.93,34.55 U11.9 ; C35.1 41.04,35.85 v2(40.42,35.85)
  Bottom Layer w0.254: v2(40.42,35.85) 38.75,35.85 v1(37.93,35.04)
$2N50518: length 6.1
  Top Layer w0.254: U11.10 38.57,34 38.95,33.61 38.95,30.51 37.71,29.27 C36.1
$2N52477: length 29
  Top Layer w0.762: 8.64,35.55 USB2.SH2 13.76,46.05 15.3,44.51 Q1.3 ; 8.64,35.55 USB2.SH1 ; 8.64,35.55 USB2.4
$3N20985: length 3.3
  Top Layer w0.203: U4.20 38.05,42.39 38.54,42.88 38.54,43.47 39.52,44.45 39.62,44.45
$4N9330: length 5.3
  Top Layer w0.254: 7.96,5.74 7.96,4.9 ; 7.96,5.74 R16.1 9.64,6.39 C27.1 ; 7.96,5.74 5.91,5.74
$4N9333: length 5.2
  Top Layer w0.254: 16.04,5.83 15.96,5.74 14.19,5.74 ; 16.04,5.83 R14.1 17.71,6.39 C13.1 ; 16.04,5.83 16.04,4.85
$4N12688: length 2.2
  Top Layer w0.508: L4.1 4.01,10.33 U7.3
$4N12690: length 2.2
  Top Layer w0.508: U5.3 12.29,10.38 L3.1

## Copper pours and planes (outline as drawn; the poured copper is in the pictures)
1V2 on Top Layer: 5.32,12.07 8.52,12.07 8.52,9.2 5.32,9.2
D3V3 on Top Layer: 13.5,12.07 16.7,12.07 16.7,9.2 13.5,9.2
GND on Top Layer: -0.73,54.64 57.08,54.64 57.08,-1.13 -0.73,-1.13
GND on Top Layer: 36.1,50.75 39.24,50.75 39.24,43.03 36.1,43.03
GND on Bottom Layer: -1.64,55.61 58.05,55.61 58.05,-2.05 -1.64,-2.05

Small or netless copper shapes (teardrops, artwork), in the pictures only: 421 on Top Layer, 56 on Bottom Layer

## Text on the board
Bottom Silkscreen Layer: github.com/ / Jackadminx/KVM-Card-mini
Document Layer: 天线阻抗匹配板厚为1.0MM / 不使用天线可忽略
Top Silkscreen Layer: JLCJLCJLCJLC | Switch | 5V+ | GND | SWD | TXD | RXD | CLK | HDMI IN | HV 2.6 | KVM Card Mini | ▶
